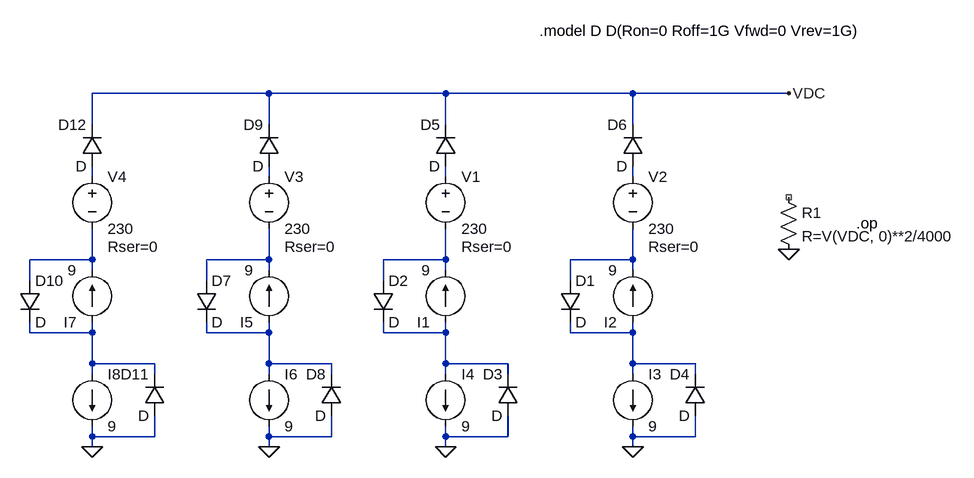
[diagram p0: schematic Generator-Test diode.asc]
Generator-Test diode.asc, the LTspice schematic file:
Version 4
SHEET 1 1108 716
WIRE -176 0 -448 0
WIRE 96 0 -176 0
WIRE 384 0 96 0
WIRE 624 0 384 0
WIRE -448 48 -448 0
WIRE -176 48 -176 0
WIRE 96 48 96 0
WIRE 384 48 384 0
WIRE -448 128 -448 112
WIRE -176 128 -176 112
WIRE 96 128 96 112
WIRE 384 128 384 112
WIRE -448 256 -448 208
WIRE -448 256 -544 256
WIRE -176 256 -176 208
WIRE -176 256 -272 256
WIRE 96 256 96 208
WIRE 96 256 0 256
WIRE 384 256 384 208
WIRE 384 256 288 256
WIRE -448 272 -448 256
WIRE -176 272 -176 256
WIRE 96 272 96 256
WIRE 384 272 384 256
WIRE -544 288 -544 256
WIRE -272 288 -272 256
WIRE 0 288 0 256
WIRE 288 288 288 256
WIRE -544 368 -544 352
WIRE -448 368 -448 352
WIRE -448 368 -544 368
WIRE -272 368 -272 352
WIRE -176 368 -176 352
WIRE -176 368 -272 368
WIRE 0 368 0 352
WIRE 96 368 96 352
WIRE 96 368 0 368
WIRE 288 368 288 352
WIRE 384 368 384 352
WIRE 384 368 288 368
WIRE -448 416 -448 368
WIRE -352 416 -448 416
WIRE -176 416 -176 368
WIRE -80 416 -176 416
WIRE 96 416 96 368
WIRE 192 416 96 416
WIRE 384 416 384 368
WIRE 480 416 384 416
WIRE -448 432 -448 416
WIRE -352 432 -352 416
WIRE -176 432 -176 416
WIRE -80 432 -80 416
WIRE 96 432 96 416
WIRE 192 432 192 416
WIRE 384 432 384 416
WIRE 480 432 480 416
WIRE -448 528 -448 512
WIRE -352 528 -352 496
WIRE -352 528 -448 528
WIRE -176 528 -176 512
WIRE -80 528 -80 496
WIRE -80 528 -176 528
WIRE 96 528 96 512
WIRE 192 528 192 496
WIRE 192 528 96 528
WIRE 384 528 384 512
WIRE 480 528 480 496
WIRE 480 528 384 528
WIRE -448 544 -448 528
WIRE -176 544 -176 528
WIRE 96 544 96 528
WIRE 384 544 384 528
FLAG 96 544 0
FLAG 384 544 0
FLAG 624 240 0
FLAG 624 0 VDC
FLAG -176 544 0
FLAG -448 544 0
DATAFLAG 96 0 ""
SYMBOL voltage 96 112 R0
WINDOW 123 0 0 Left 0
WINDOW 39 24 124 Left 2
SYMATTR SpiceLine Rser=0
SYMATTR InstName V1
SYMATTR Value 230
SYMBOL voltage 384 112 R0
WINDOW 123 0 0 Left 0
WINDOW 39 24 124 Left 2
SYMATTR SpiceLine Rser=0
SYMATTR InstName V2
SYMATTR Value 230
SYMBOL current 96 352 R180
WINDOW 123 0 0 Left 0
WINDOW 39 0 0 Left 0
SYMATTR InstName I1
SYMATTR Value 9
SYMBOL current 384 352 R180
WINDOW 123 0 0 Left 0
WINDOW 39 0 0 Left 0
SYMATTR InstName I2
SYMATTR Value 9
SYMBOL diode 272 288 R0
SYMATTR InstName D1
SYMBOL diode -16 288 R0
SYMATTR InstName D2
SYMBOL current 384 432 R0
WINDOW 123 0 0 Left 0
WINDOW 39 0 0 Left 0
SYMATTR InstName I3
SYMATTR Value 9
SYMBOL current 96 432 R0
WINDOW 123 0 0 Left 0
WINDOW 39 0 0 Left 0
SYMATTR InstName I4
SYMATTR Value 9
SYMBOL diode 208 496 R180
WINDOW 0 24 64 Left 2
WINDOW 3 24 0 Left 2
SYMATTR InstName D3
SYMBOL diode 496 496 R180
WINDOW 0 24 64 Left 2
WINDOW 3 24 0 Left 2
SYMATTR InstName D4
SYMBOL diode 112 112 R180
WINDOW 0 24 64 Left 2
WINDOW 3 24 0 Left 2
SYMATTR InstName D5
SYMBOL diode 400 112 R180
WINDOW 0 24 64 Left 2
WINDOW 3 24 0 Left 2
SYMATTR InstName D6
SYMBOL res 608 144 R0
SYMATTR InstName R1
SYMATTR Value R=V(VDC, 0)**2/4000
SYMBOL voltage -176 112 R0
WINDOW 123 0 0 Left 0
WINDOW 39 24 124 Left 2
SYMATTR SpiceLine Rser=0
SYMATTR InstName V3
SYMATTR Value 230
SYMBOL current -176 352 R180
WINDOW 123 0 0 Left 0
WINDOW 39 0 0 Left 0
SYMATTR InstName I5
SYMATTR Value 9
SYMBOL diode -288 288 R0
SYMATTR InstName D7
SYMBOL current -176 432 R0
WINDOW 123 0 0 Left 0
WINDOW 39 0 0 Left 0
SYMATTR InstName I6
SYMATTR Value 9
SYMBOL diode -64 496 R180
WINDOW 0 24 64 Left 2
WINDOW 3 24 0 Left 2
SYMATTR InstName D8
SYMBOL diode -160 112 R180
WINDOW 0 24 64 Left 2
WINDOW 3 24 0 Left 2
SYMATTR InstName D9
SYMBOL voltage -448 112 R0
WINDOW 123 0 0 Left 0
WINDOW 39 24 124 Left 2
SYMATTR SpiceLine Rser=0
SYMATTR InstName V4
SYMATTR Value 230
SYMBOL current -448 352 R180
WINDOW 123 0 0 Left 0
WINDOW 39 0 0 Left 0
SYMATTR InstName I7
SYMATTR Value 9
SYMBOL diode -560 288 R0
SYMATTR InstName D10
SYMBOL current -448 432 R0
WINDOW 123 0 0 Left 0
WINDOW 39 0 0 Left 0
SYMATTR InstName I8
SYMATTR Value 9
SYMBOL diode -336 496 R180
WINDOW 0 24 64 Left 2
WINDOW 3 24 0 Left 2
SYMATTR InstName D11
SYMBOL diode -432 112 R180
WINDOW 0 24 64 Left 2
WINDOW 3 24 0 Left 2
SYMATTR InstName D12
TEXT 728 200 Left 2 !.op
TEXT 240 -96 Left 2 !.model D D(Ron=0 Roff=1G Vfwd=0 Vrev=1G)

The netlist it stands for:
* Generator-Test diode.asc
V1 N003 N007 230 Rser=0
V2 N004 N008 230 Rser=0
I1 N011 N007 9
I2 N012 N008 9
D1 N008 N012 D
D2 N007 N011 D
I3 N012 0 9
I4 N011 0 9
D3 0 N011 D
D4 0 N012 D
D5 N003 VDC D
D6 N004 VDC D
R1 NC_01 0 R=V(VDC, 0)**2/4000
V3 N002 N006 230 Rser=0
I5 N010 N006 9
D7 N006 N010 D
I6 N010 0 9
D8 0 N010 D
D9 N002 VDC D
V4 N001 N005 230 Rser=0
I7 N009 N005 9
D10 N005 N009 D
I8 N009 0 9
D11 0 N009 D
D12 N001 VDC D
.model D D
.lib standard.dio
.op
.model D D(Ron=0 Roff=1G Vfwd=0 Vrev=1G)
.backanno
.end